# EAGLE design EXPS2 (EAGLE 7.2.0)
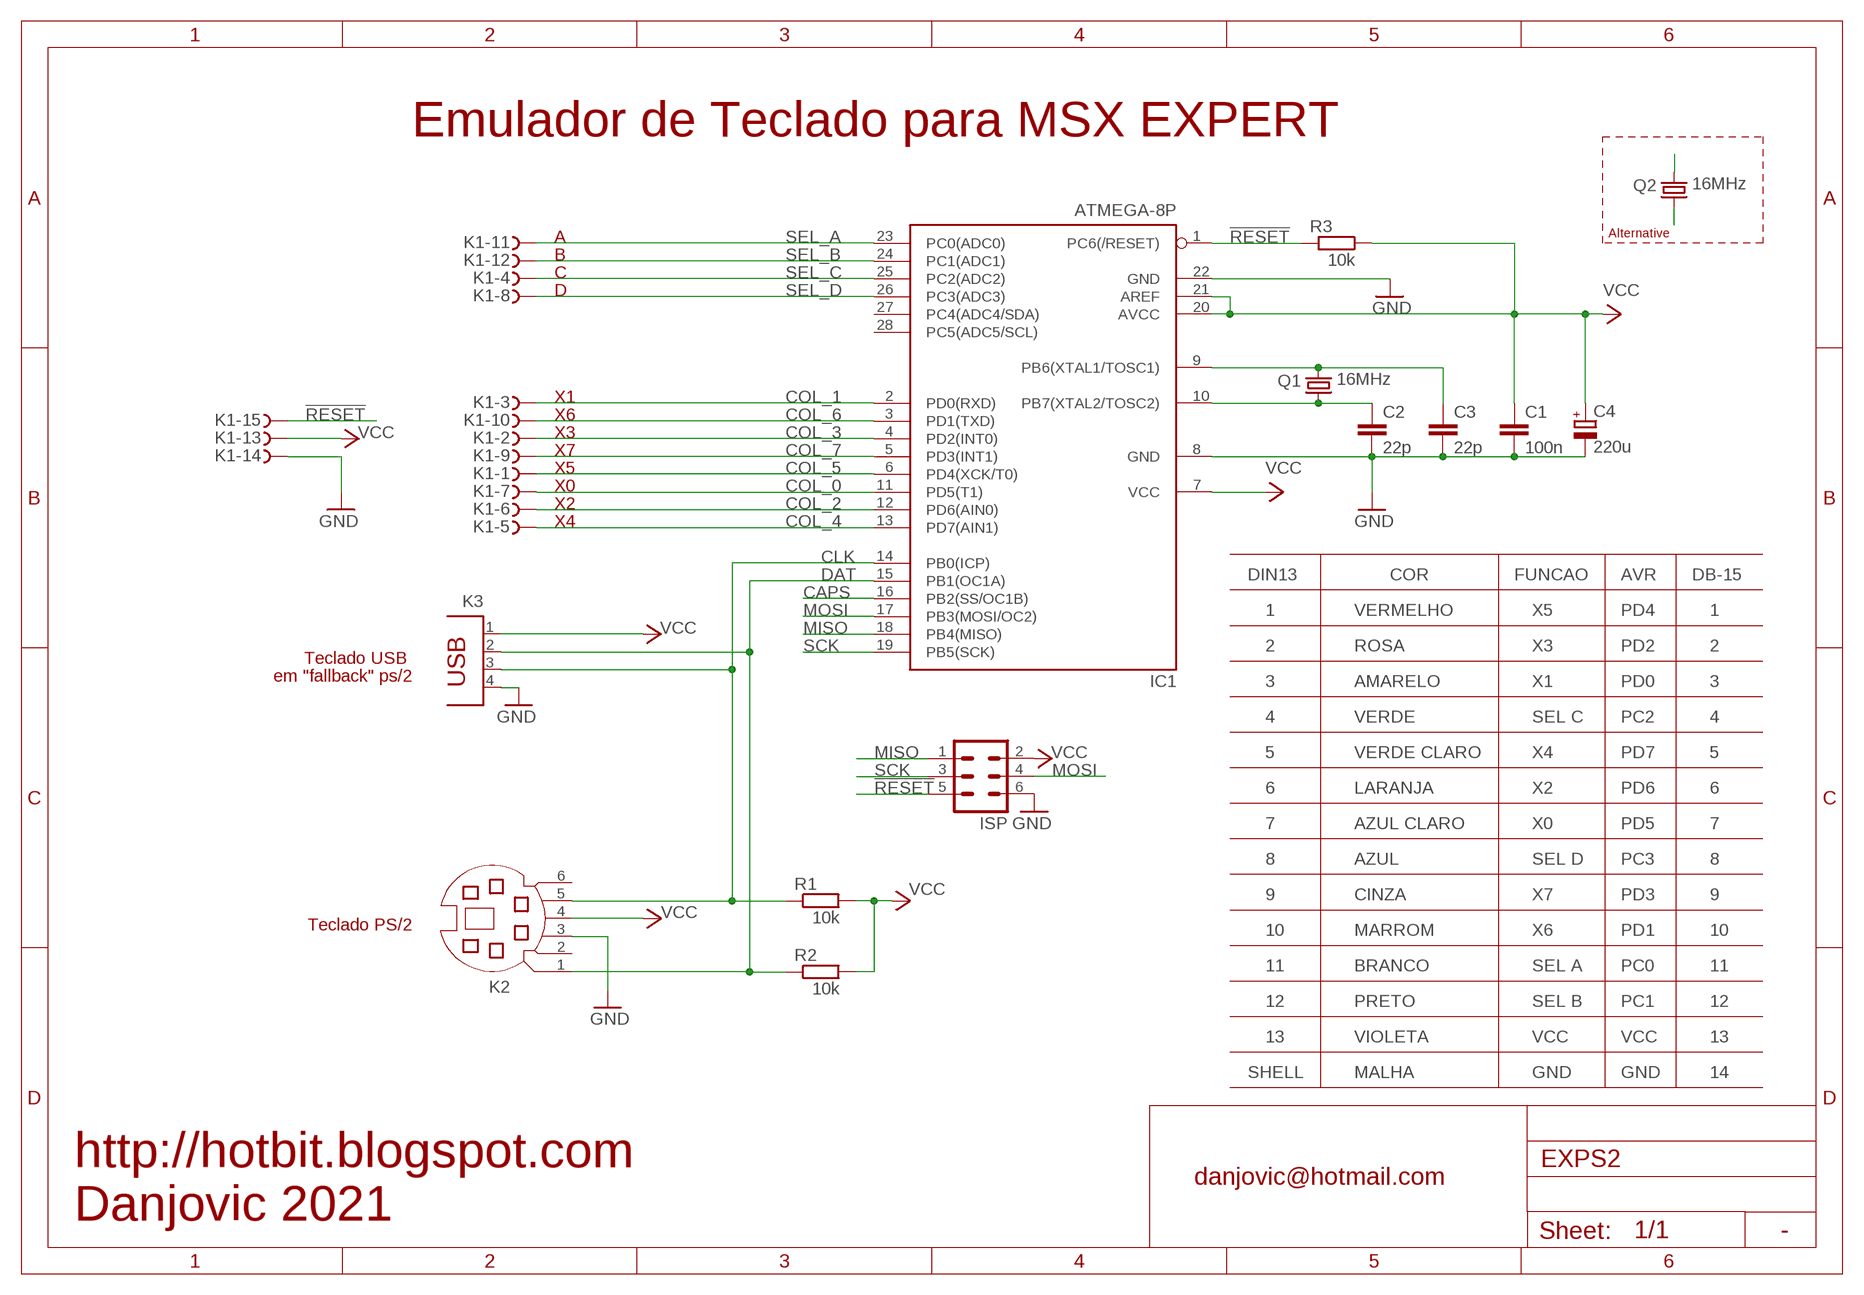
[diagram p0: schematic, sheet 1]

## Parts
C1  100n  C-EU050-024X044  [C050-024X044]
C2  22p  C-EU050-024X044  [C050-024X044]
C3  22p  C-EU050-024X044  [C050-024X044]
C4  220u  CPOL-EUE2.5-6  [E2,5-6]
IC1  ATMEGA-8P  MEGA8-P  [DIL28-3]
ISP  ML6  [ML6]
K1  F15HPS  [F15HP]
K2  MD06S  [MDIN06S]
K3  PN87520  [PN87520]
Q1  16MHz  CRYSTALHC49U-V  [HC49U-V]
Q2  16MHz  CRYSTALTC26H  [TC26H]
R1  10k  R-EU_0204/7  [0204/7]
R2  10k  R-EU_0204/7  [0204/7]
R3  10k  R-EU_0204/7  [0204/7]

## Nets
!RESET: IC1.1(PC6(/RESET)) ISP.5 K1.15 R3.2
CAPS: IC1.16(PB2(SS/OC1B))
CLK: IC1.14(PB0(ICP)) K2.5 K3.3 R1.1
COL_0: IC1.11(PD5(T1)) K1.7
COL_1: IC1.2(PD0(RXD)) K1.3
COL_2: IC1.12(PD6(AIN0)) K1.6
COL_3: IC1.4(PD2(INT0)) K1.2
COL_4: IC1.13(PD7(AIN1)) K1.5
COL_5: IC1.6(PD4(XCK/T0)) K1.1
COL_6: IC1.3(PD1(TXD)) K1.10
COL_7: IC1.5(PD3(INT1)) K1.9
DAT: IC1.15(PB1(OC1A)) K2.1 K3.2 R2.1
GND: C1.2 C2.2 C3.2 C4.- IC1.8(GND) IC1.22(GND) ISP.6 K1.14 K2.3 K3.4
MISO: IC1.18(PB4(MISO)) ISP.1
MOSI: IC1.17(PB3(MOSI/OC2)) ISP.4
SCK: IC1.19(PB5(SCK)) ISP.3
SEL_A: IC1.23(PC0(ADC0)) K1.11
SEL_B: IC1.24(PC1(ADC1)) K1.12
SEL_C: IC1.25(PC2(ADC2)) K1.4
SEL_D: IC1.26(PC3(ADC3)) K1.8
VCC: C1.1 C4.+ IC1.7(VCC) IC1.20(AVCC) IC1.21(AREF) ISP.2 K1.13 K2.4 K3.1 R1.2 R2.2 R3.1
XTAL1: C3.1 IC1.9(PB6(XTAL1/TOSC1)) Q1.2 Q2.2
XTAL2: C2.1 IC1.10(PB7(XTAL2/TOSC2)) Q1.1 Q2.1
Unconnected: IC1.27(PC4(ADC4/SDA)) IC1.28(PC5(ADC5/SCL)) K2.2 K2.6

## Notes on the sheet
- Emulador de Teclado para MSX EXPERT
- Alternative
- A
- B
- C
- D
- X1
- X6
- X3
- X7
- X5
- X0
- X2
- X4
- DIN13 | COR | FUNCAO | AVR | DB-15
- CAPS
- 1 | VERMELHO | X5 | PD4 | 1
- Teclado USB | 2 | ROSA | X3 | PD2 | 2
- em "fallback" ps/2
- 3 | AMARELO | X1 | PD0 | 3
- 4 | VERDE | SEL C | PC2 | 4
- 5 | VERDE CLARO | X4 | PD7 | 5
- 6 | LARANJA | X2 | PD6 | 6
- 7 | AZUL CLARO | X0 | PD5 | 7
- 8 | AZUL | SEL D | PC3 | 8
- 9 | CINZA | X7 | PD3 | 9
- Teclado PS/2
- 10 | MARROM | X6 | PD1 | 10
- 11 | BRANCO | SEL A | PC0 | 11
- 12 | PRETO | SEL B | PC1 | 12
- 13 | VIOLETA | VCC | VCC | 13
- SHELL | MALHA | GND | GND | 14
- http://hotbit.blogspot.com
- danjovic@hotmail.com
- Danjovic 2021
- -

## Library data of the parts
C1-C3 = rcl:C-EU: CAPACITOR, European symbol
C4 = rcl:CPOL-EU: POLARIZED CAPACITOR, European symbol
IC1 = atmel:MEGA8-P: MICROCONTROLLER 8 Kbytes FLASH, 1 kbytes SRAM, 512 bytes EEPROM, USART, 4-channel 10 bit ADC, 2-channel 8 bit ADC Pin compatible with Atmega48, ATMega88, ATMega168 Source: avr.lbr; OC_FARNELL: unknown; OC_NEWARK: unknown
ISP = con-harting-ml:ML6: HARTING; OC_FARNELL: unknown; OC_NEWARK: unknown
K1 = con-subd:F15?S: SUB-D; OC_FARNELL: unknown; OC_NEWARK: unknown
K2 = con-yamaichi:MD06S: YAMAICHI CONNECTOR; OC_FARNELL: unknown; OC_NEWARK: unknown
K3 = con-berg:PN87520: BERG USB connector; OC_FARNELL: unknown; OC_NEWARK: unknown
Q1 = crystal:CRYSTAL: CRYSTAL; OC_FARNELL: 1666969; OC_NEWARK: unknown
Q2 = crystal:CRYSTAL: CRYSTAL; OC_FARNELL: unknown; OC_NEWARK: unknown
R1-R3 = rcl:R-EU_: RESISTOR, European symbol

## Board
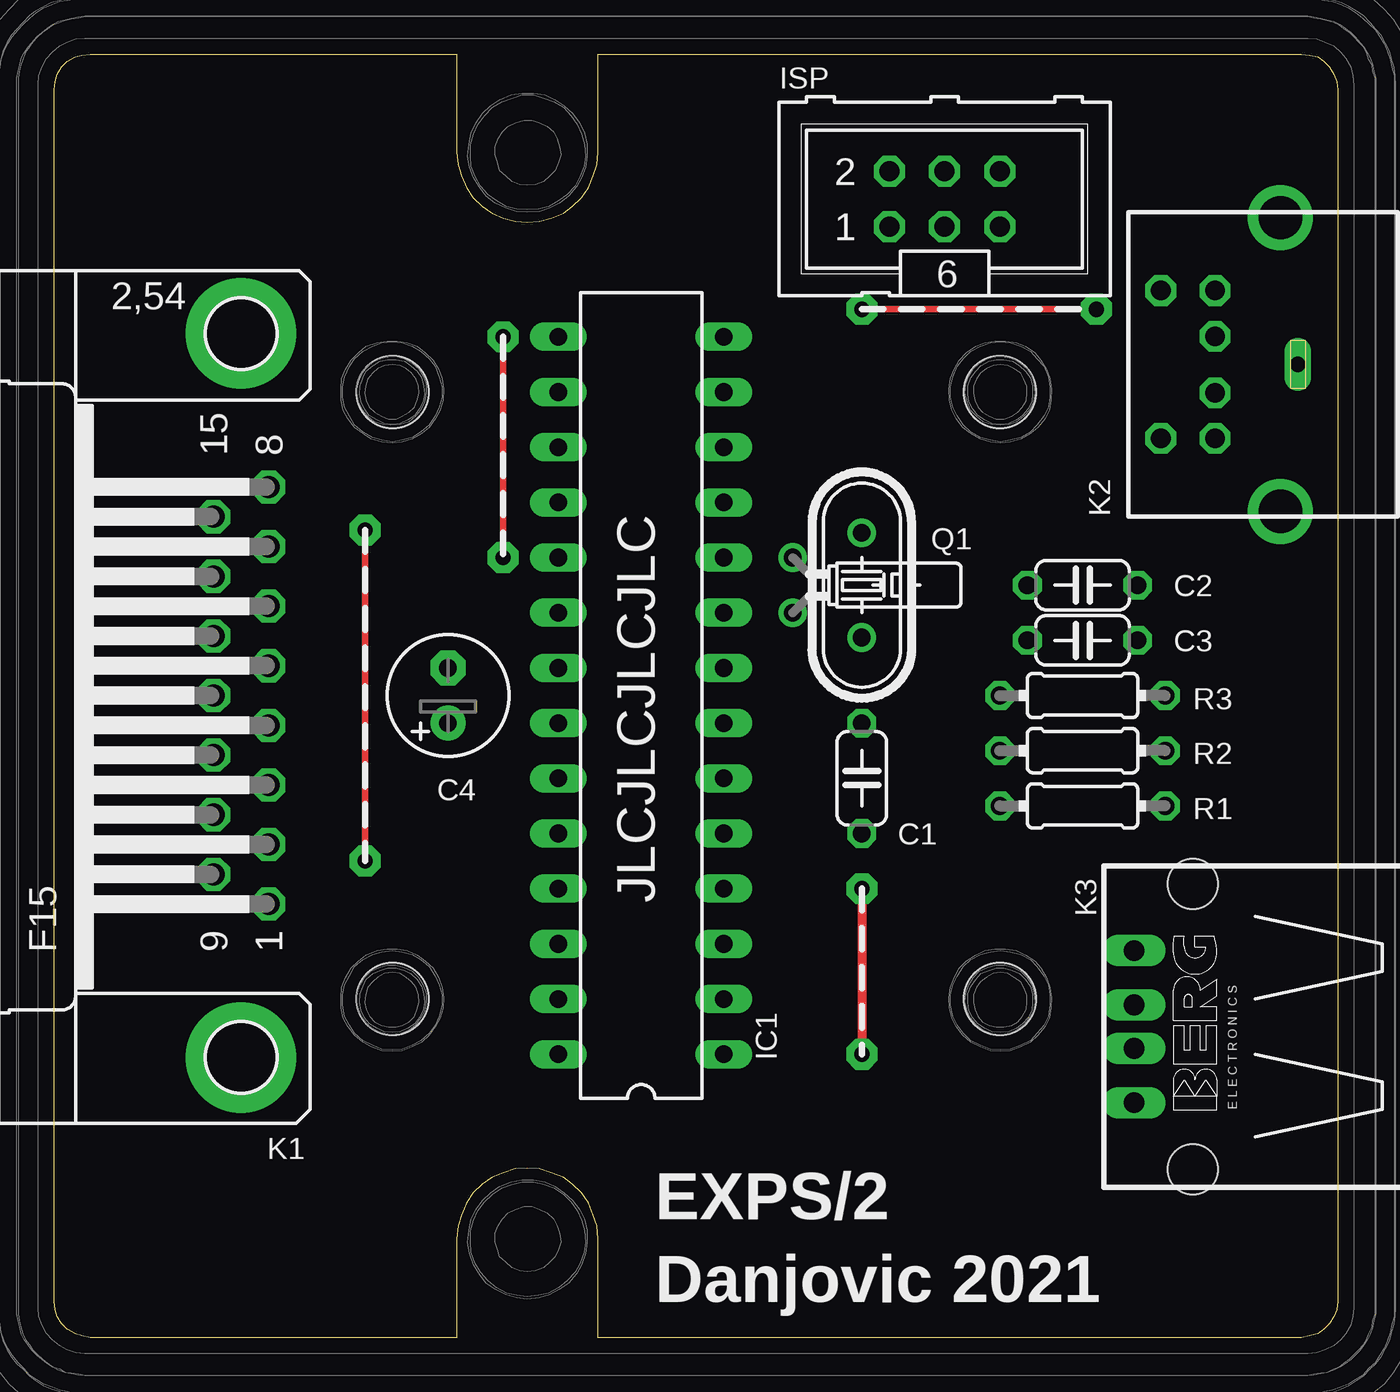
[diagram p1: board, top side]
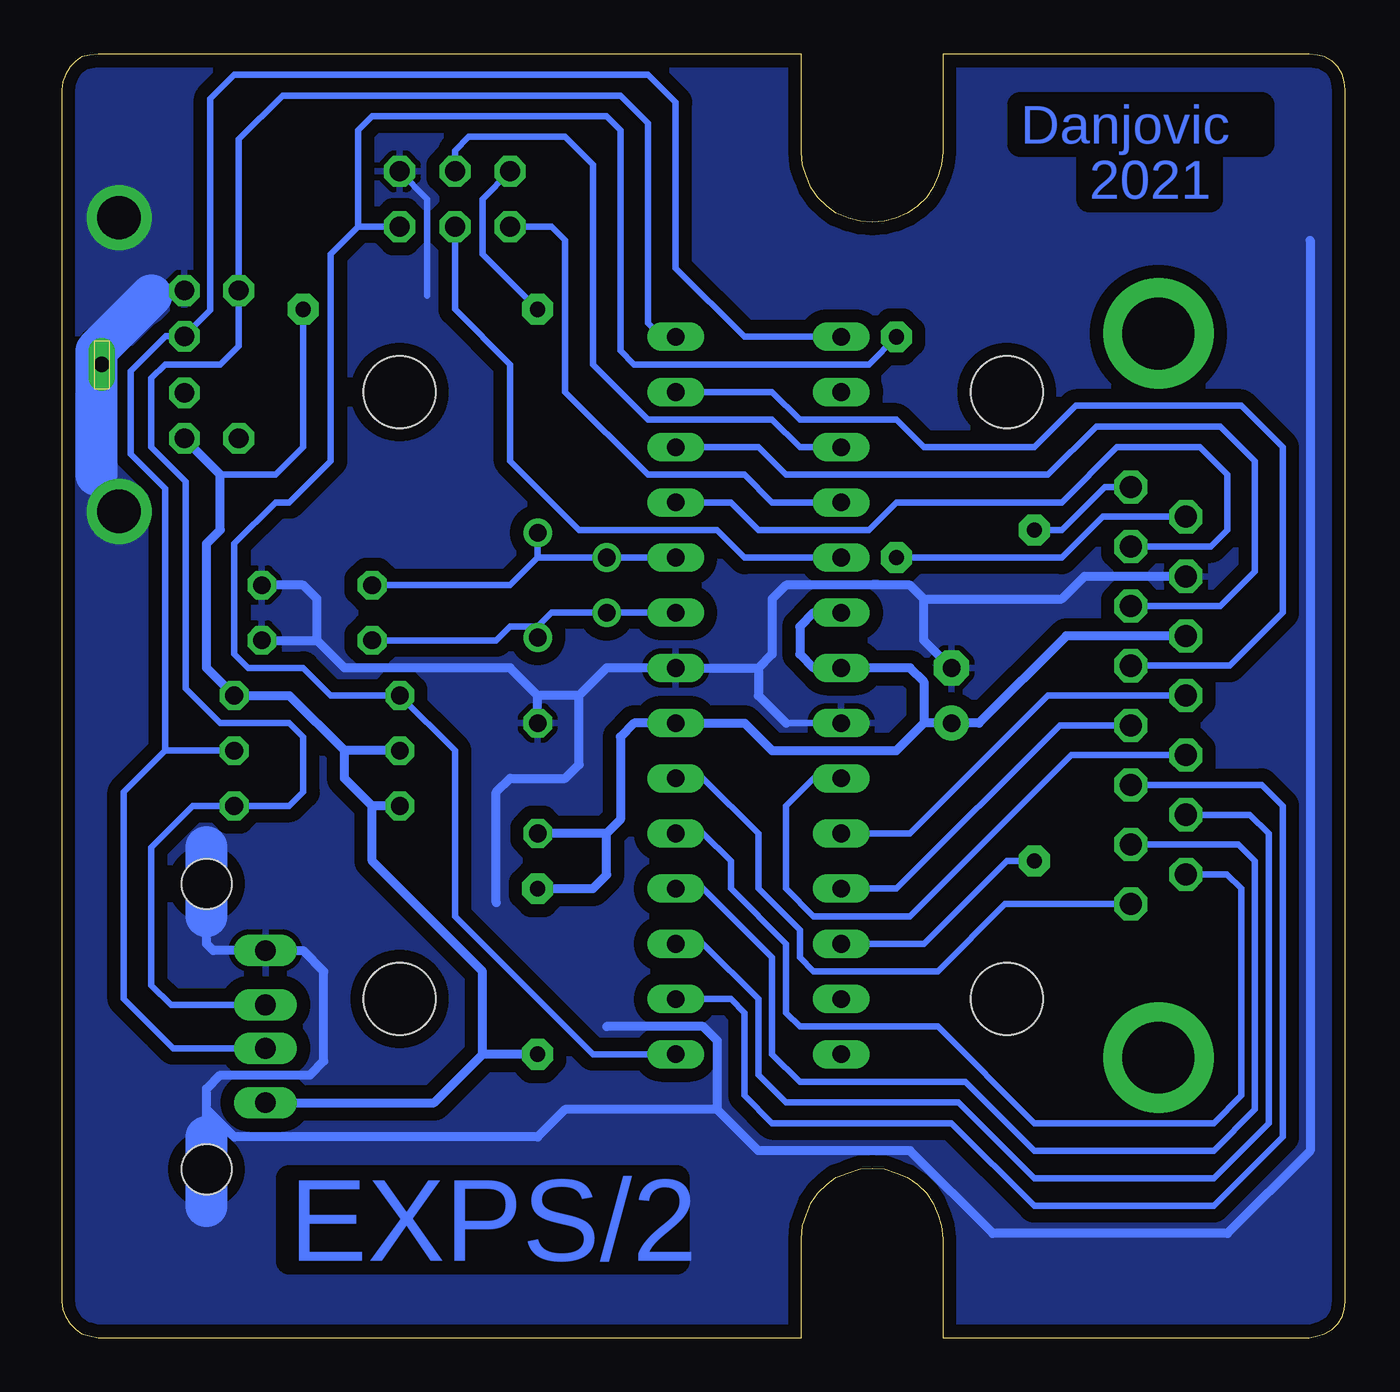
[diagram p2: board, bottom side, seen from below]

Size 59.07 x 59.07 mm. Coordinates in mm from the lower left corner, seen from the top.
Copper layers (1*16): Top 0.035mm / dielectric 1.5mm / Bottom 0.035mm
Design rules "default *": minimum track width 10mil, minimum drill 24mil, track to track 8mil, track to pad 8mil, pad to pad 8mil, via to via 8mil, smd to smd 8mil, copper to edge 15mil, drill to drill 8mil, minimum pad ring 10mil, minimum via ring 8mil, stop-mask expansion 4mil, vias tented up to drill 0mil, thermal gap 10mil

### Footprints (pad centres in the part's own frame; a part is rotated, then mirrored left to right if it is on the bottom)
C050-024X044 = drill 0.813 octagon: 1 -2.54,0; 2 2.54,0
E2,5-6 = drill 0.813 pad 1.6: + -1.27,0 | drill 0.813 pad 1.6 octagon: - 1.27,0
DIL28-3 = drill 0.813 long: 1 -16.51,-3.81; 2 -13.97,-3.81; 3 -11.43,-3.81; 4 -8.89,-3.81; 5 -6.35,-3.81; 6 -3.81,-3.81; 7 -1.27,-3.81; 8 1.27,-3.81; 9 3.81,-3.81; 10 6.35,-3.81; 11 8.89,-3.81; 12 11.43,-3.81; 13 13.97,-3.81; 14 16.51,-3.81; 15 16.51,3.81; 16 13.97,3.81; 17 11.43,3.81; 18 8.89,3.81; 19 6.35,3.81; 20 3.81,3.81; 21 1.27,3.81; 22 -1.27,3.81; 23 -3.81,3.81; 24 -6.35,3.81; 25 -8.89,3.81; 26 -11.43,3.81; 27 -13.97,3.81; 28 -16.51,3.81
ML6 = drill 0.914 octagon: 1 -2.54,-1.27; 2 -2.54,1.27; 3 0,-1.27; 4 0,1.27; 5 2.54,-1.27; 6 2.54,1.27
F15HP = drill 1.016 octagon: 1 -9.601,-1.27; 2 -6.858,-1.27; 3 -4.115,-1.27; 4 -1.372,-1.27; 5 1.372,-1.27; 6 4.115,-1.27; 7 6.858,-1.27; 8 9.601,-1.27; 9 -8.23,1.27; 10 -5.486,1.27; 11 -2.743,1.27; 12 0,1.27; 13 2.743,1.27; 14 5.486,1.27; 15 8.23,1.27 | drill 3.302 pad 5.08: G1 -16.662,0; G2 16.662,0
MDIN06S = drill 0.9 octagon: 1 1.3,8.5; 2 -1.3,8.5; 3 3.4,8.5; 4 -3.4,8.5; 5 3.4,11; 6 -3.4,11 | drill 0.7 long: M 0,4.7
PN87520 = drill 0.95 long: 1 -3.5,2.71; 2 -1,2.71; 3 1,2.71; 4 3.5,2.71 | hole 2.3: -6.57,0; 6.57,0
HC49U-V = drill 0.813: 1 -2.413,0; 2 2.413,0
TC26H = drill 0.813: 1 -1.27,0; 2 1.27,0
0204/7 = drill 0.813 octagon: 1 -3.81,0; 2 3.81,0
1593J = hole 3.302: -13.97,-13.97; 13.97,-13.97; -13.97,13.97; 13.97,13.97

### Placement (x,y rotation side)
C1  37.17,25.74 90 top
C2  47.33,34.63 0 top
C3  47.33,32.09 0 top
C4  18.12,29.55 90 top
IC1  27.01,29.55 90 top
ISP  40.98,52.41 0 top
K1  8.6,29.55 90 top
K2  61.94,44.79 90 top
K3  52.41,14.31 90 top
Q1  37.17,34.63 270 top
Q2  34,34.63 270 top
R1  47.33,24.47 180 top
R2  47.33,27.01 180 top
R3  47.33,29.55 180 top
U$1  [1593J]  29.55,29.55 270 top

### Tracks (layer width: path | path; a pad name or v marks a point on that pad's centre or on a via)
!RESET  (via drill 0.7 pad 1.42)
  Top 0.305: v20.66,46.06 v20.66,35.9
  Bottom 0.305: 7.3,37.81 K1.15 11.16,37.78 13.04,35.9 v20.66,35.9 | IC1.1 34.63,13.04 40.98,19.39 40.98,27.01 R3.2 46.7,29.55 47.97,30.82 50.51,30.82 51.14,31.46 51.14,36.54 49.24,38.44 48.6,38.44 46.7,40.35 46.7,49.87 45.43,51.14 | 45.43,51.14 45.43,55.59 44.79,56.22 34,56.22 33.36,55.59 33.36,45.43 32.73,44.79 21.93,44.79 v20.66,46.06 | ISP.5 45.43,51.14
CLK
  Bottom 0.305: K3.3 54.05,15.31 54.95,16.22 54.95,22.57 53.05,24.47 R1.1 48.6,24.47 47.97,25.11 47.97,27.65 48.6,28.28 51.78,28.28 53.36,29.87 53.36,39.39 54.95,40.98 54.95,44.16 54.32,44.79 51.78,44.79 50.94,45.63 K2.5 50.94,55.16 48.92,57.17 33.36,57.17 32.09,55.91 32.09,46.7 31.46,46.06 IC1.14
COL_0
  Bottom 0.305: K1.7 6.18,36.41 5.42,37.17 5.42,39.71 6.69,40.98 10.5,40.98 13.04,38.44 20.66,38.44 21.93,37.17 27.01,37.17 28.28,38.44 IC1.11
COL_1
  Bottom 0.305: K1.3 3.85,25.44 2.88,24.47 2.88,9.23 6.06,6.06 14.31,6.06 18.12,9.87 26.38,9.87 27.65,11.14 27.65,14.95 28.28,15.58 IC1.2
COL_2
  Bottom 0.305: IC1.12 27.01,40.98 25.74,39.71 13.68,39.71 11.46,41.93 5.74,41.93 4.15,40.35 4.15,35.27 5.75,33.67 K1.6
COL_3
  Bottom 0.305: IC1.4 29.55,20.66 26.38,17.49 26.38,13.04 25.11,11.77 17.49,11.77 14.31,8.6 6.06,8.6 4.15,10.5 4.15,21.93 4.91,22.69 K1.2
COL_4
  Bottom 0.305: K1.5 5.32,30.92 2.88,33.36 2.88,40.98 4.79,42.89 12.41,42.89 14.31,40.98 19.39,40.98 20.66,42.25 25.11,42.25 26.38,43.52 IC1.13
COL_5
  Bottom 0.305: IC1.6 29.55,25.74 27.01,23.2 27.01,20.66 25.11,18.76 25.11,17.49 24.47,16.85 18.76,16.85 15.66,19.95 K1.1
COL_6
  Bottom 0.305: K1.10 4.38,24.07 3.52,23.2 3.52,9.87 6.06,7.33 14.31,7.33 17.81,10.82 25.74,10.82 27.01,12.09 27.01,15.58 29.55,18.12 IC1.3
COL_7
  Bottom 0.305: IC1.5 29.55,23.2 28.28,21.93 28.28,20.66 25.74,18.12 25.74,14.95 25.11,14.31 18.76,14.31 14.31,9.87 6.06,9.87 4.79,11.14 4.79,20.66 5.45,21.32 K1.9
DAT
  Bottom 0.305: R2.1 54.32,27.01 | K3.2 53.95,13.31 56.22,15.58 56.22,25.11 54.32,27.01 | 54.32,27.01 54.32,39.08 55.91,40.67 55.91,44.48 54.29,46.09 K2.1 52.25,47.28 52.25,57.02 51.14,58.13 32.09,58.13 30.82,56.86 30.82,49.24 27.65,46.06 IC1.15
GND  (via drill 2 pad 1.42)
  Bottom 0.305: IC1.22 25.74,28.28 | ISP.6 42.25,52.41 42.25,47.97
  Bottom 0.406: 34,14.31 29.55,14.31 28.92,13.68 28.92,10.5 | 1.61,50.51 1.61,8.6 5.42,4.79 16.22,4.79 20.03,8.6 27.01,8.6 28.92,10.5 | 28.92,10.5 35.9,10.5 37.17,9.23 51.14,9.23 52.41,10.5 | 52.41,10.5 52.41,11.46 51.78,12.09 47.65,12.09 47.02,12.72 47.02,16.85 47.98,17.81 K3.4 52.1,17.81 52.41,18.12 52.41,19.39 | 27.01,30.82 26.38,31.46 26.38,34 25.74,34.63 20.03,34.63 19.39,34 | 27.01,30.82 27.01,29.55 25.74,28.28 | 27.01,30.82 IC1.8 34,30.82 35.27,29.55 | 35.27,29.55 37.17,29.55 | 39.08,20.03 39.08,25.11 38.44,25.74 35.9,25.74 35.27,26.38 35.27,29.55 | C1.2 37.17,29.55 | 37.17,29.55 38.44,30.82 46.06,30.82 47.33,32.09 | 47.33,32.09 47.33,34 47.97,34.63 C2.2 | C3.2 47.33,32.09 | K1.14 12,35.04 13.04,34 19.39,34 | C4.- 19.39,32.09 19.39,34 | 52.41,9.23 52.41,10.5
  Bottom 1.93: 54.95,47.97 57.49,45.43 57.49,39.71 | 52.41,19.39 52.41,22.57 | 52.41,6.06 52.41,9.23
  other vias: 56.44,51.55 56.44,38.03
  pour Bottom (isolate 0.61): -0.29,-0.29 -0.29,59.4 60.03,59.4 60.03,-0.29
MISO
  Bottom 0.305: IC1.18 26.38,38.44 27.65,39.71 32.09,39.71 35.9,43.52 35.9,50.51 36.54,51.14 ISP.1
MOSI
  Bottom 0.305: IC1.17 25.11,40.98 26.38,42.25 32.09,42.25 34.63,44.79 34.63,54 35.9,55.27 40.35,55.27 40.98,54.63 ISP.4
SCK
  Bottom 0.305: IC1.19 27.65,35.9 28.92,37.17 35.27,37.17 38.44,40.35 38.44,44.79 40.98,47.33 ISP.3
SEL_A
  Bottom 0.305: IC1.23 24.47,25.74 25.74,24.47 25.74,20.66 24.47,19.39 20.03,19.39 12.61,26.81 K1.11
SEL_B
  Bottom 0.305: K1.12 13.68,29.55 20.03,23.2 IC1.24
SEL_C
  Bottom 0.305: K1.4 13.14,28.18 20.66,20.66 IC1.25
SEL_D  (via drill 0.7 pad 1.42)
  Top 0.305: v14.31,37.17 v14.31,21.93
  Bottom 0.305: IC1.26 19.39,18.12 15.58,21.93 v14.31,21.93 | K1.8 11.06,39.15 13.04,37.17 v14.31,37.17
VCC  (via drill 0.7 pad 1.42)
  Top 0.305: v37.17,47.33 v47.97,47.33
  Top 0.406: v37.17,20.66 v37.17,13.04
  Bottom 0.305: ISP.2 39.71,52.41 39.71,49.87 v37.17,47.33 | v47.97,47.33 47.97,40.98 49.24,39.71 51.78,39.71
  Bottom 0.406: R2.2 46.06,27.01 | 46.06,27.01 48.6,29.55 R3.1 52.41,30.82 52.41,36.54 51.78,37.17 51.78,39.71 53.44,41.37 K2.4 | 34,23.2 33.36,23.84 33.36,27.65 32.73,28.28 IC1.7 27.65,28.28 26.38,27.01 20.66,27.01 19.39,28.28 | 34,23.2 C1.1 | IC1.20 24.47,33.36 25.11,32.73 25.11,31.46 24.47,30.82 IC1.21 20.03,30.82 19.39,30.19 19.39,28.28 | K1.13 12.84,32.3 16.85,28.28 C4.+ 19.39,28.28 | v37.17,20.66 34.63,20.66 34,21.3 34,23.2 | K3.1 41.94,10.81 39.71,13.04 | 39.71,13.04 39.71,16.85 44.79,21.93 44.79,24.47 | v37.17,13.04 39.71,13.04 | 44.79,24.47 46.06,25.74 46.06,27.01 | R1.2 44.79,24.47
XTAL1
  Bottom 0.305: IC1.9 Q2.2 36.54,33.36 37.17,32.73 | 37.17,32.73 38.44,32.73 39.08,32.09 C3.1 | 37.17,32.73 Q1.2
XTAL2
  Bottom 0.305: IC1.10 Q2.1 37.17,35.9 | 37.17,35.9 Q1.1 | C2.1 38.44,34.63 37.17,35.9

### Text on the board
Bottom: Danjovic | 2021 | EXPS/2
tPlace: JLCJLCJLCJLC | EXPS/2 | Danjovic 2021